# EasyEDA Pro project ProPrj_DSP BOARD_2026-03-01.epro, schematic ESP32S3_AD/DA
Board Name: Board2; Create Date: 2026-03-01; Page Name: P1; Project Name: DSP BOARD; Schematic Name: ESP32S3_AD/DA; Update Date: 2026-03-01; Company: EasyEDA.com; Drawn: SUGEX; Page Size: A4; Version: V1.0
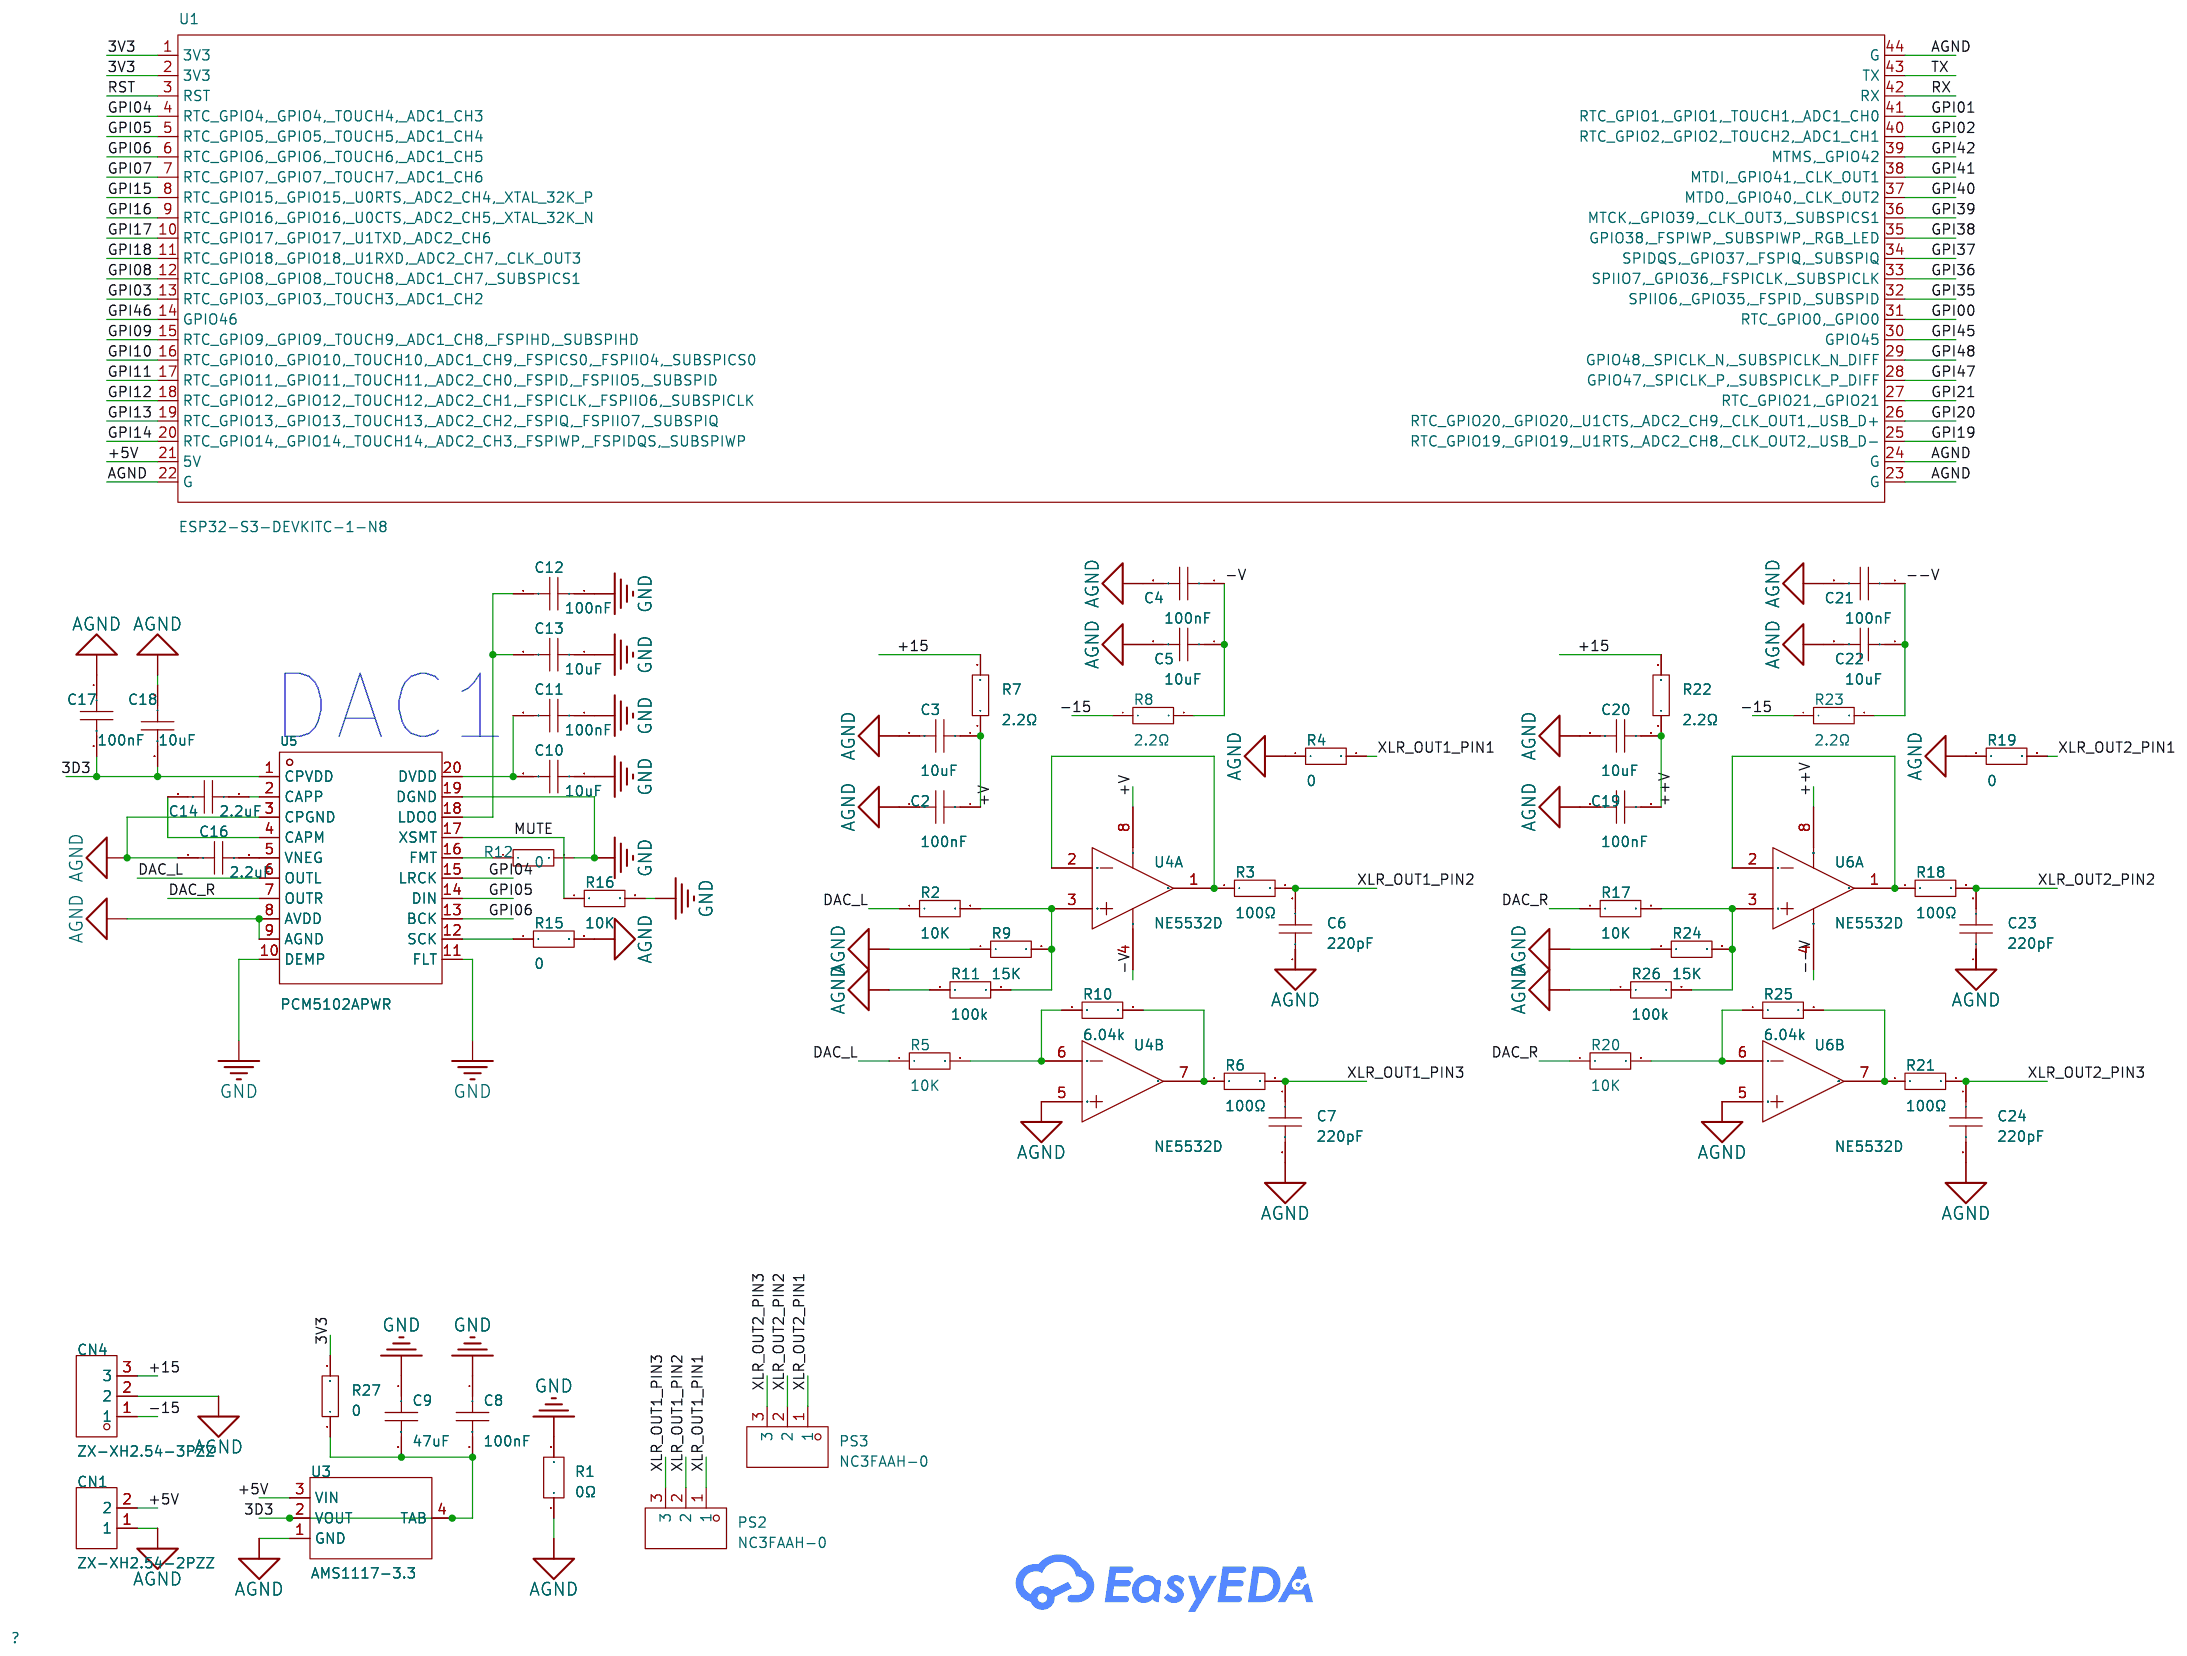
[diagram p1: schematic sheet]

## Parts
C2  100nF  [C0603]
C3  10uF  [C0603]
C4  100nF  [C0603]
C5  10uF  [C0603]
C6  220pF  [C0603]
C7  220pF  [C0603]
C8  100nF  [C0603]
C9  47uF  [C0603]
C10  10uF  [C0603]
C11  100nF  [C0603]
C12  100nF  [C0603]
C13  10uF  [C0603]
C14  2.2uF  [C0603]
C16  2.2uF  [C0603]
C17  100nF  [C0603]
C18  10uF  [C0603]
C19  100nF  [C0603]
C20  10uF  [C0603]
C21  100nF  [C0603]
C22  10uF  [C0603]
C23  220pF  [C0603]
C24  220pF  [C0603]
CN1  ZX-XH2.54-2PZZ  [CONN-TH_2P-P2.50_HX25003-2A]  (no BOM)
CN4  ZX-XH2.54-3PZZ  [CONN-TH_3P-P2.54_2501S-3P]  (no BOM)
PS2  NC3FAAH-0  [CONN-TH_NC3FAAH-0]
PS3  NC3FAAH-0  [CONN-TH_NC3FAAH-0]
R1  0Ω  [R0402]
R2  10K  [R0603]
R3  100Ω  [R0603]
R4  0  [R0603]
R5  10K  [R0603]
R6  100Ω  [R0603]
R7  2.2Ω  [R0603]
R8  2.2Ω  [R0603]
R9  15K  [R0603]
R10  6.04k  [R0603]
R11  100k  [R0603]
R12  0  [R0603]
R15  0  [R0603]
R16  10K  [R0603]
R17  10K  [R0603]
R18  100Ω  [R0603]
R19  0  [R0603]
R20  10K  [R0603]
R21  100Ω  [R0603]
R22  2.2Ω  [R0603]
R23  2.2Ω  [R0603]
R24  15K  [R0603]
R25  6.04k  [R0603]
R26  100k  [R0603]
R27  0  [R0603]
U1  ESP32-S3-DEVKITC-1-N8  [CONN-TH_ESP32-S3-DEVKITC-1U-N8]  (no BOM)
U3  AMS1117-3.3  [SOT-223-3_L6.5-W3.5-P3.05-LS7.0]
U4  NE5532D  [SOP-8_L4.9-W3.9-P1.27-LS6.0-BL]  (sections 1,2)
U5  PCM5102APWR  [TSSOP-20_L6.5-W4.4-P0.65-LS6.4-BL]
U6  NE5532D  [SOP-8_L4.9-W3.9-P1.27-LS6.0-BL]  (sections 1,2)

## Library data of the parts
C2-C14 C16-C24 = CAP_0603: Supplier Footprint: 0603
CN1 = ZX-XH2.54-2PZZ: Pins Structure:1x2P Pitch:2.5mm Mounting Type:Through Hole Reference Series:XH Number of Pins:2P Number of Rows:1 Number of PINs Per Row:2 Row Spacing:- Current Rating:2A Contact Material:Brass Contact Plating:Tin Operating Temperature:-25℃~+85℃ Operating; LCSC Part Name: 1x2P 间距:2.5mm 直插 系列:XH; Supplier Part: C7429632; Manufacturer: Megastar(兆星); Supplier Footprint: 插件,P=2.5mm; JLCPCB Part Class: Extended Part; Datasheet: https://item.szlcsc.com/datasheet/ZX-XH2.54-2PZZ/8427549.html; Supplier: LCSC; Pins Structure: 1x2P; Pitch: 2.5mm; Mounting Type: Through Hole; Reference Series: XH; Number of Pins: 2P; Number of Rows: 1; Number of PINs Per Row: 2; Current Rating: 2A; Contact Material: Brass; Contact Plating: Tin; Operating Temperature: -25℃~+85℃; Voltage Rating: 250V; Plastic Material: PA66; Flame Retardant Rating: UL94V-0; Color: White; Z-Height of the Board: 7mm; X-Length of Bottom Edge on Board (Spacing Line): 7.5mm; Y-Width of Bottom Edge on Board: 5.9mm
CN4 = ZX-XH2.54-3PZZ: Pins Structure:1x3P Pitch:2.5mm Mounting Type:Through Hole Reference Series:XH Number of Pins:3P Number of Rows:1 Number of PINs Per Row:3 Row Spacing:- Current Rating:3A Contact Material:Brass Contact Plating:Tin Operating Temperature:-25℃~+85℃ Operating; LCSC Part Name: 1x3P 间距:2.5mm 直插 系列:XH; Supplier Part: C7429633; Manufacturer: Megastar(兆星); Supplier Footprint: 插件,P=2.5mm; JLCPCB Part Class: Extended Part; Datasheet: https://item.szlcsc.com/datasheet/ZX-XH2.54-3PZZ/8427550.html; Supplier: LCSC; Pins Structure: 1x3P; Pitch: 2.5mm; Mounting Type: Through Hole; Reference Series: XH; Number of Pins: 3P; Number of Rows: 1; Number of PINs Per Row: 3; Current Rating: 3A; Contact Material: Brass; Contact Plating: Tin; Operating Temperature: -25℃~+85℃; Voltage Rating: 250V; Plastic Material: PA66; Flame Retardant Rating: UL94V-0; Color: White; Z-Height of the Board: 7mm; X-Length of Bottom Edge on Board (Spacing Line): 10mm; Y-Width of Bottom Edge on Board: 5.9mm
PS2 PS3 = NC3FAAH-0: Supplier Part: C368506; Manufacturer: NEUTRIK(优曲克); Supplier Footprint: 插件; JLCPCB Part Class: Extended Part; Datasheet: https://item.szlcsc.com/datasheet/NC3FAAH-0/342493.html; Supplier: LCSC
R1 = FRC0402P000 TS: Type:Thick Film Resistor Resistance:0Ω Tolerance:±5% Tolerance:±5% Power(Watts):62.5mW Voltage-Supply(Max):50V Operating Temperature:-55℃~+155℃ Operating Temperature:-55℃~+155℃; LCSC Part Name: 0Ω ±5% 62.5mW 厚膜电阻; Supplier Part: C2906877; Manufacturer: FOJAN(富捷); Supplier Footprint: 0402; JLCPCB Part Class: Extended Part; Supplier: LCSC; Type: Thick Film Resistor; Tolerance: ±5%; Power(Watts): 62.5mW; Voltage-Supply(Max): 50V; Operating Temperature: -55℃~+155℃
R2-R12 R15-R27 = Res_0603: Supplier Footprint: 0603
U1 = ESP32-S3-DEVKITC-1-N8: Supplier Part: C20438410; Manufacturer: ESPRESSIF(乐鑫); JLCPCB Part Class: Extended Part; Supplier: LCSC
U3 = AMS1117-3.3_C5250992: Output Type:Fixed Voltage - Supply:12V Output Voltage:3.3V Output Voltage:3.3V Output Current:1A Power Supply Rejection Ratio (PSRR):70dB@(120Hz) Voltage Dropout:1.4V@(1A) standby current:3mA Noise:0.003%Vout Features:Over Temperature Protection Operating; LCSC Part Name: 3.3V 1A 12V; Supplier Part: C5250992; Manufacturer: TWGMC(迪嘉); Supplier Footprint: SOT-223-3L; JLCPCB Part Class: Extended Part; Datasheet: https://item.szlcsc.com/datasheet/AMS1117-3.3/5967328.html; Supplier: LCSC; Output Type: Fixed; Voltage - Supply: 12V; Output Voltage: 3.3V; Output Current: 1A; Power Supply Rejection Ratio (PSRR): 70dB@(120Hz); Voltage Dropout: 1.4V@(1A); standby current: 3mA; Noise: 0.003%Vout; Features: Over Temperature Protection; Operating Temperature: -40℃~+125℃@(Tj); Output Configuration: Positive; Number of Outputs: 1
U4 U6 = NE5532D: Voltage - Supply:5V~15V；-15V~-5V Voltage - Supply:5V~15V；-15V~-5V Quiescent Current:16mA Operating Temperature:0℃~+70℃ Operating Temperature:0℃~+70℃ Power Supply Rejection Ratio (PSRR):100dB; LCSC Part Name: Op Amps-Comparators; Supplier Part: C354126; Manufacturer: TI(德州仪器); Supplier Footprint: SOIC-8; JLCPCB Part Class: Extended Part; Datasheet: https://www.ti.com/cn/lit/gpn/sa5532a; Supplier: LCSC; Voltage - Supply: 5V~15V；-15V~-5V; Quiescent Current: 16mA; Operating Temperature: 0℃~+70℃; Power Supply Rejection Ratio (PSRR): 100dB
U5 = PCM5102APWR: Interface Type:PCM Supply Voltage:1.65V~3.46V Supply Voltage:1.65V~3.46V Number of Channels:2 Resolution:24；16；32 Operating Temperature:-25℃~+85℃ Operating Temperature:-25℃~+85℃; Supplier Part: C107671; Manufacturer: TI(德州仪器); Supplier Footprint: TSSOP-20; JLCPCB Part Class: Extended Part; Datasheet: https://www.ti.com/cn/lit/gpn/pcm5102a; Supplier: LCSC; Interface Type: PCM; Supply Voltage: 1.65V~3.46V; Number of Channels: 2; Resolution: 24；16；32; Operating Temperature: -25℃~+85℃

## Nets
3V3: R27.2 U1.1(3V3) U1.2(3V3)
+5V: CN1.2 U1.21(5V) U3.3(VIN)
AGND: C2.2 C3.2 C4.2 C5.2 C6.1 C7.2 C16.1 C17.1 C18.1 C19.2 C20.2 C21.2 C22.2 C23.1 C24.2 CN1.1 CN4.2 R1.1 R4.1 R9.1 R11.1 R15.2 R19.1 R24.1 R26.1 U1.22(G) U1.23(G) U1.24(G) U1.44(G) U3.1(GND) U4.5(IN2+) U5.3(CPGND) U5.8(AVDD) U5.9(AGND) U6.5(IN2+)
GND: C8.1 C9.1 C10.1 C11.1 C12.1 C13.1 R1.2 R12.2 R16.2 U5.10(DEMP) U5.11(FLT) U5.19(DGND)
3D3: C8.2 C9.2 C17.2 C18.2 R27.1 U3.2(VOUT) U3.4(TAB) U5.1(CPVDD)
+15: CN4.3 R7.2 R22.2
++V: C19.1 C20.1 R22.1 U6.8(Vcc+)
+V: C2.1 C3.1 R7.1 U4.8(Vcc+)
-15: CN4.1 R8.1 R23.1
--V: C21.1 C22.1 R23.2 U6.4(Vcc-)
-V: C4.1 C5.1 R8.2 U4.4(Vcc-)
DAC_L: R2.1 R5.1 U5.6(OUTL)
DAC_R: R17.1 R20.1 U5.7(OUTR)
GPI00: U1.31(RTC_GPIO0, GPIO0)
GPI01: U1.41(RTC_GPIO1, GPIO1, TOUCH1, ADC1_CH0)
GPI02: U1.40(RTC_GPIO2, GPIO2, TOUCH2, ADC1_CH1)
GPI03: U1.13(RTC_GPIO3, GPIO3, TOUCH3, ADC1_CH2)
GPI04: U1.4(RTC_GPIO4, GPIO4, TOUCH4, ADC1_CH3) U5.15(LRCK)
GPI05: U1.5(RTC_GPIO5, GPIO5, TOUCH5, ADC1_CH4) U5.14(DIN)
GPI06: U1.6(RTC_GPIO6, GPIO6, TOUCH6, ADC1_CH5) U5.13(BCK)
GPI07: U1.7(RTC_GPIO7, GPIO7, TOUCH7, ADC1_CH6)
GPI08: U1.12(RTC_GPIO8, GPIO8, TOUCH8, ADC1_CH7, SUBSPICS1)
GPI09: U1.15(RTC_GPIO9, GPIO9, TOUCH9, ADC1_CH8, FSPIHD, SUBSPIHD)
GPI10: U1.16(RTC_GPIO10, GPIO10, TOUCH10, ADC1_CH9, FSPICS0, FSPIIO4, SUBSPICS0)
GPI11: U1.17(RTC_GPIO11, GPIO11, TOUCH11, ADC2_CH0, FSPID, FSPIIO5, SUBSPID)
GPI12: U1.18(RTC_GPIO12, GPIO12, TOUCH12, ADC2_CH1, FSPICLK, FSPIIO6, SUBSPICLK)
GPI13: U1.19(RTC_GPIO13, GPIO13, TOUCH13, ADC2_CH2, FSPIQ, FSPIIO7, SUBSPIQ)
GPI14: U1.20(RTC_GPIO14, GPIO14, TOUCH14, ADC2_CH3, FSPIWP, FSPIDQS, SUBSPIWP)
GPI15: U1.8(RTC_GPIO15, GPIO15, U0RTS, ADC2_CH4, XTAL_32K_P)
GPI16: U1.9(RTC_GPIO16, GPIO16, U0CTS, ADC2_CH5, XTAL_32K_N)
GPI17: U1.10(RTC_GPIO17, GPIO17, U1TXD, ADC2_CH6)
GPI18: U1.11(RTC_GPIO18, GPIO18, U1RXD, ADC2_CH7, CLK_OUT3)
GPI19: U1.25(RTC_GPIO19, GPIO19, U1RTS, ADC2_CH8, CLK_OUT2, USB_D-)
GPI20: U1.26(RTC_GPIO20, GPIO20, U1CTS, ADC2_CH9, CLK_OUT1, USB_D+)
GPI21: U1.27(RTC_GPIO21, GPIO21)
GPI35: U1.32(SPIIO6, GPIO35, FSPID, SUBSPID)
GPI36: U1.33(SPIIO7, GPIO36, FSPICLK, SUBSPICLK)
GPI37: U1.34(SPIDQS, GPIO37, FSPIQ, SUBSPIQ)
GPI38: U1.35(GPIO38, FSPIWP, SUBSPIWP, RGB LED)
GPI39: U1.36(MTCK, GPIO39, CLK_OUT3, SUBSPICS1)
GPI40: U1.37(MTDO, GPIO40, CLK_OUT2)
GPI41: U1.38(MTDI, GPIO41, CLK_OUT1)
GPI42: U1.39(MTMS, GPIO42)
GPI45: U1.30(GPIO45)
GPI46: U1.14(GPIO46)
GPI47: U1.28(GPIO47, SPICLK_P, SUBSPICLK_P_DIFF)
GPI48: U1.29(GPIO48, SPICLK_N, SUBSPICLK_N_DIFF)
MUTE: R16.1 U5.17(XSMT)
RST: U1.3(RST)
RX: U1.42(RX)
TX: U1.43(TX)
XLR_OUT1_PIN1: PS2.1 R4.2
XLR_OUT1_PIN2: C6.2 PS2.2 R3.2
XLR_OUT1_PIN3: C7.1 PS2.3 R6.2
XLR_OUT2_PIN1: PS3.1 R19.2
XLR_OUT2_PIN2: C23.2 PS3.2 R18.2
XLR_OUT2_PIN3: C24.1 PS3.3 R21.2
$1N13090: R3.1 U4.1(OUT1) U4.2(IN1-)
$1N33160: R2.2 R9.2 R11.2 U4.3(IN1+)
$1N35156: R5.2 R10.1 U4.6(IN2-)
$1N35160: R6.1 R10.2 U4.7(OUT2)
$1N35428: C10.2 C11.2 U5.20(DVDD)
$1N35634: C12.2 C13.2 U5.18(LDOO)
$1N35671: R12.1 U5.16(FMT)
$1N35875: R15.1 U5.12(SCK)
$1N35928: C14.1 U5.2(CAPP)
$1N35932: C14.2 U5.4(CAPM)
$1N36160: C16.2 U5.5(VNEG)
$1N37272: R20.2 R25.1 U6.6(IN2-)
$1N37276: R21.1 R25.2 U6.7(OUT2)
$1N37285: R17.2 R24.2 R26.2 U6.3(IN1+)
$1N37312: R18.1 U6.1(OUT1) U6.2(IN1-)

## Notes on the sheet
- DAC1
